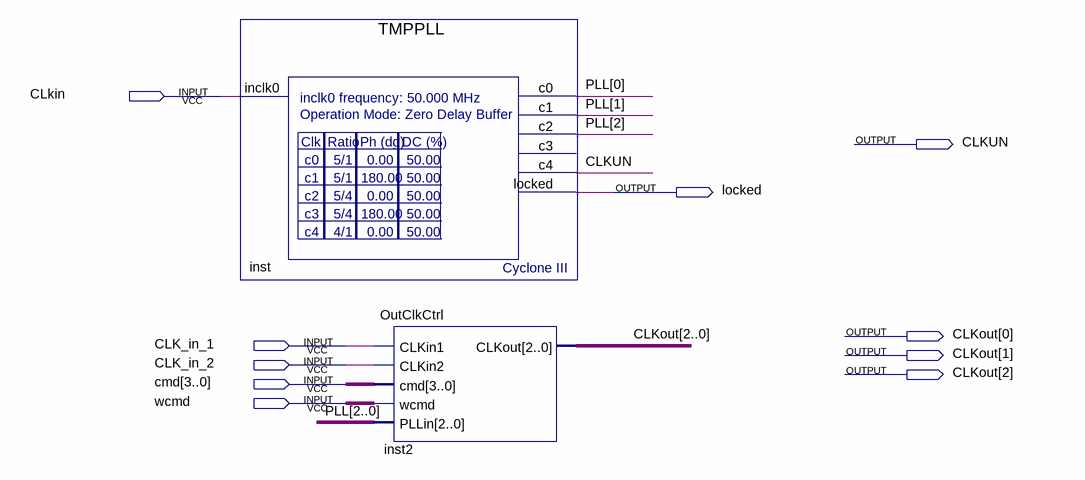
[diagram p0: schematic sheet]
// Quartus schematic PLL_TIMER.bdf as structural Verilog: 2 symbols, 10 pins
module PLL_TIMER (
  input  CLkin,
  input  CLK_in_1,
  input  CLK_in_2,
  input  [3:0] cmd,
  input  wcmd,
  output CLKUN,
  output locked,
  output [2:0] CLKout
);

  wire [2:0] PLL;

  TMPPLL inst (.inclk0(CLkin), .c0(PLL[0]), .c1(PLL[1]), .c2(PLL[2]), .c4(CLKUN), .locked(locked));  // open: c3
  OutClkCtrl inst2 (.CLKin1(CLK_in_1), .CLKin2(CLK_in_2), .cmd(cmd), .wcmd(wcmd), .PLLin(PLL), .CLKout(CLKout));
endmodule
